# EAGLE design Zio Qwiic Eink Display Red 2.9 (EAGLE 9.1.0)
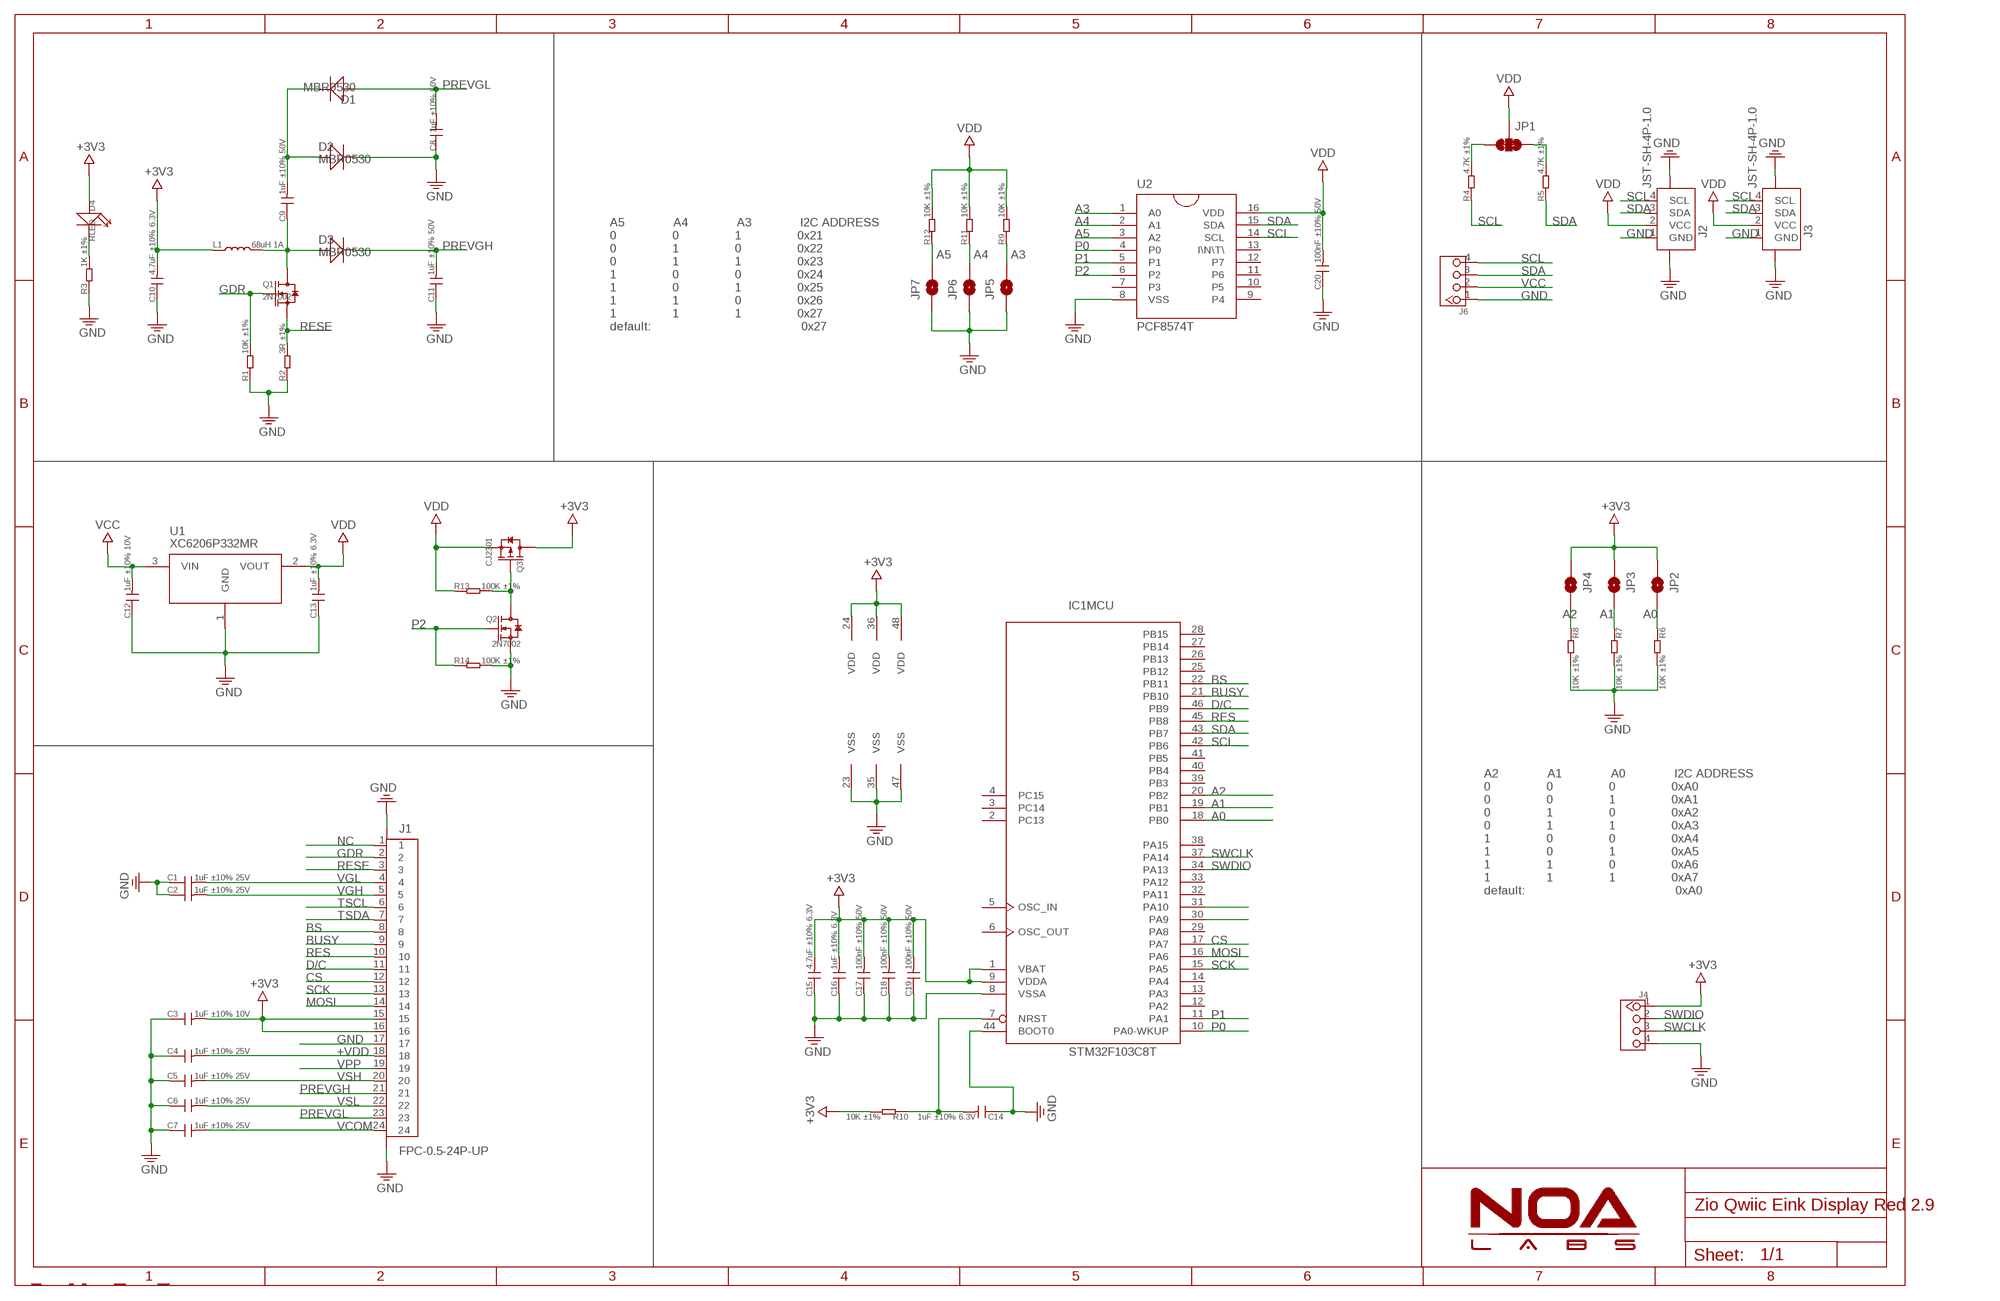
[diagram p0: schematic, sheet 1]

## Parts
C1  1uF ±10% 25V  C-0603  [C0603]
C2  1uF ±10% 25V  C-0603  [C0603]
C3  1uF ±10% 10V  C-0603  [C0603]
C4  1uF ±10% 25V  C-0603  [C0603]
C5  1uF ±10% 25V  C-0603  [C0603]
C6  1uF ±10% 25V  C-0603  [C0603]
C7  1uF ±10% 25V  C-0603  [C0603]
C8  1uF ±10% 50V  C-0603  [0603]
C9  1uF ±10% 50V  C-0603  [C0603]
C10  4.7uF ±10% 6.3V  C-0603  [C0603]
C11  1uF ±10% 50V  C-0603  [C0603]
C12  1uF ±10% 10V  C-0603  [C0603]
C13  1uF ±10% 6.3V  C-0603  [C0603]
C14  1uF ±10% 6.3V  C-0603  [C0603]
C15  4.7uF ±10% 6.3V  C-0603  [C0603]
C16  1uF ±10% 6.3V  C-0603  [C0603]
C17  100nF ±10% 50V  C-0603  [C0603]
C18  100nF ±10% 50V  C-0603  [C0603]
C19  100nF ±10% 50V  C-0603  [C0603]
C20  100nF ±10% 50V  C-0603  [C0603]
D1  MBR0530  D'1206'  [SOD123]
D2  MBR0530  D'1206'  [SOD123]
D3  MBR0530  D'1206'  [SOD123]
D4  RLED  LED'0603'  [LED-0603]
IC1  STM32F103C8T  [LQFP48]
J1  FPC-0.5-24P-UP  [FPC-0.5-24P_UP]
J2  JST-SH-4P-1.0  [JST-SH-4P]
J3  JST-SH-4P-1.0  [JST-SH-4P]
J4  HEADER-4P-2.54-SMD  [4P-2.54-SMD-180]
J6  HEADER-4P-60/35MIL  [4P-65/35MIL]
JP1  SMT-JUMPER_3_2-NC_TRACE  [SMT-JUMPER_3_2-NC_TRACE]
JP2  JUMPER-SMT_2_NC_PASTE_NOCREM  [SMT-JUMPER_2_NC_PASTE_SILK_NOCREM]
JP3  JUMPER-SMT_2_NC_PASTE_NOCREM  [SMT-JUMPER_2_NC_PASTE_SILK_NOCREM]
JP4  JUMPER-SMT_2_NC_PASTE_NOCREM  [SMT-JUMPER_2_NC_PASTE_SILK_NOCREM]
JP5  JUMPER-SMT_2_NC_PASTE_NOCREM  [SMT-JUMPER_2_NC_PASTE_SILK_NOCREM]
JP6  JUMPER-SMT_2_NC_PASTE_NOCREM  [SMT-JUMPER_2_NC_PASTE_SILK_NOCREM]
JP7  JUMPER-SMT_2_NC_PASTE_NOCREM  [SMT-JUMPER_2_NC_PASTE_SILK_NOCREM]
L1  68uH 1A  L-3012  [L3012]
Q1  2N7002  MOSFET-N-SOT23  [SOT23]
Q2  2N7002  MOSFET-N-SOT23  [SOT23]
Q3  CJ2301  MOSFET-P-SOT23  [SOT23]
R1  10K ±1%  R-0603  [R0603]
R2  3R ±1%  R-0603  [R0603]
R3  1K ±1%  R-0603  [R0603]
R4  4.7K ±1%  R-0603  [R0603]
R5  4.7K ±1%  R-0603  [R0603]
R6  10K ±1%  R-0603  [R0603]
R7  10K ±1%  R-0603  [R0603]
R8  10K ±1%  R-0603  [R0603]
R9  10K ±1%  R-0603  [R0603]
R10  10K ±1%  R-0603  [R0603]
R11  10K ±1%  R-0603  [R0603]
R12  10K ±1%  R-0603  [R0603]
R13  100K ±1%  R-0603  [R0603]
R14  100K ±1%  R-0603  [R0603]
U1  XC6206P332MR  XC6206MR  [SOT23]
U2  PCF8574T  [SO16-W]

## Nets
+3V3: C3.2 C10.2 C15.2 C16.2 C17.2 C18.2 C19.2 D4.+ IC1.1(MCU:VBAT) IC1.9(MCU:VDDA) IC1.24(VDD) IC1.36(VDD) IC1.48(VDD) J1.15 J1.16 J4.1 JP2.1 JP3.1 JP4.1 L1.1 Q3.3(D) R10.2
+VDD: C4.2 J1.18
A0: IC1.18(MCU:PB0) JP2.2 R6.1
A1: IC1.19(MCU:PB1) JP3.2 R7.1
A2: IC1.20(MCU:PB2) JP4.2 R8.1
A3: JP5.2 R9.1 U2.1(A0)
A4: JP6.2 R11.1 U2.2(A1)
A5: JP7.2 R12.1 U2.3(A2)
BS: IC1.22(MCU:PB11) J1.8
BUSY: IC1.21(MCU:PB10) J1.9
CS: IC1.17(MCU:PA7) J1.12
D/C: IC1.46(MCU:PB9) J1.11
GDR: J1.2 Q1.1(G) R1.2
GND: C1.1 C2.1 C3.1 C4.1 C5.1 C6.1 C7.1 C8.1 C10.1 C11.1 C12.1 C13.1 C14.1 C15.1 C16.1 C17.1 C18.1 C19.1 C20.1 D2.- IC1.8(MCU:VSSA) IC1.23(VSS) IC1.35(VSS) IC1.44(MCU:BOOT0) IC1.47(VSS) J1.17 J1.25(G1) J1.26(G2) J2.1(GND) J2.NC1 J2.NC2 J3.1(GND) J3.NC1 J3.NC2 J4.4 J6.1 JP5.1 JP6.1 JP7.1 Q2.2(S) R1.1 R2.1 R3.1 R6.2 R7.2 R8.2 R14.2 U1.1(GND) U2.8(VSS)
MOSI: IC1.16(MCU:PA6) J1.14
N$1: IC1.31(MCU:PA10)
N$2: C9.2 D1.- D2.+
N$3: C9.1 D3.+ L1.2 Q1.3(D)
N$4: IC1.30(MCU:PA9)
N$5: C14.2 IC1.7(MCU:NRST) R10.1
N$6: JP1.3 R4.2
N$7: D4.- R3.2
N$8: JP1.1 R5.2
N$9: Q2.3(D) Q3.1(G) R13.2
NC: J1.1
P0: IC1.10(MCU:PA0-WKUP) U2.4(P0)
P1: IC1.11(MCU:PA1) U2.5(P1)
P2: Q2.1(G) R14.1 U2.6(P2)
PREVGH: C11.2 D3.- J1.21
PREVGL: C8.2 D1.+ J1.23
RES: IC1.45(MCU:PB8) J1.10
RESE: J1.3 Q1.2(S) R2.2
SCK: IC1.15(MCU:PA5) J1.13
SCL: IC1.42(MCU:PB6) J2.4(SCL) J3.4(SCL) J6.4 R4.1 U2.14(SCL)
SDA: IC1.43(MCU:PB7) J2.3(SDA) J3.3(SDA) J6.3 R5.1 U2.15(SDA)
SWCLK: IC1.37(MCU:PA14) J4.3
SWDIO: IC1.34(MCU:PA13) J4.2
TSCL: J1.6
TSDA: J1.7
VCC: C12.2 J6.2 U1.3(VIN)
VCOM: C7.2 J1.24
VDD: C13.2 C20.2 J2.2(VCC) J3.2(VCC) JP1.2 Q3.2(S) R9.2 R11.2 R12.2 R13.1 U1.2(VOUT) U2.16(VDD)
VGH: C2.2 J1.5
VGL: C1.2 J1.4
VPP: J1.19
VSH: C5.2 J1.20
VSL: C6.2 J1.22
Unconnected: IC1.2(MCU:PC13) IC1.3(MCU:PC14) IC1.4(MCU:PC15) IC1.5(MCU:OSC_IN) IC1.6(MCU:OSC_OUT) IC1.12(MCU:PA2) IC1.13(MCU:PA3) IC1.14(MCU:PA4) IC1.25(MCU:PB12) IC1.26(MCU:PB13) IC1.27(MCU:PB14) IC1.28(MCU:PB15) IC1.29(MCU:PA8) IC1.32(MCU:PA11) IC1.33(MCU:PA12) IC1.38(MCU:PA15) IC1.39(MCU:PB3) IC1.40(MCU:PB4) IC1.41(MCU:PB5) U2.7(P3) U2.9(P4) U2.10(P5) U2.11(P6) U2.12(P7) U2.13(I\N\T\)

## Notes on the sheet
- A5              A4              A3              I2C ADDRESS
  0                0                1                0x21
  0                1                0                0x22
  0                1                1                0x23
  1                0                0                0x24
  1                0                1                0x25
  1                1                0                0x26
  1                1                1                0x27
  default:                                           0x27
- A2              A1              A0              I2C ADDRESS
  0                0                0                0xA0
  0                0                1                0xA1
  0                1                0                0xA2
  0                1                1                0xA3
  1                0                0                0xA4
  1                0                1                0xA5
  1                1                0                0xA6
  1                1                1                0xA7
  default:                                           0xA0

## Library data of the parts
C1-C7 C9-C20 = RCL:C
C8 = Discretex:C*: Ceramic Capacitors
D1-D3 = Discrete_NOA:D*
D4 = Discrete_NOA:LED*
IC1 = micro-stm_v3:STM32F103C*T: ARM 32-bit Cortex™-M3 CPU 72 MHz maximum frequency 16 to 128 Kbytes of Flash memory 6 to 20 kbytes of SRAM 37 GPIOs 2.0 to 3.6 V application supply
J1 = Connector:FPC-0.5-24P
J2 J3 = Connector:JST-SH-4P
J4 = Connector:HEADER-4P
J6 = Connector_NOA:HEADER-4P
JP1 = NOA-Jumpers:SMT-JUMPER_3_2-NC_TRACE
JP2-JP7 = NOA-Jumpers:JUMPER-SMT_2_NC_PASTE_NOCREM
L1 = RCL:L
Q1 = Discretex:MOSFET-N
Q2 = Discrete_NOA:MOSFET-N
Q3 = Discrete_NOA:MOSFET-P
R1-R14 = RCL:R
U1 = IC_NOA:XC6206MR
U2 = IC:PCF8574T

## Board
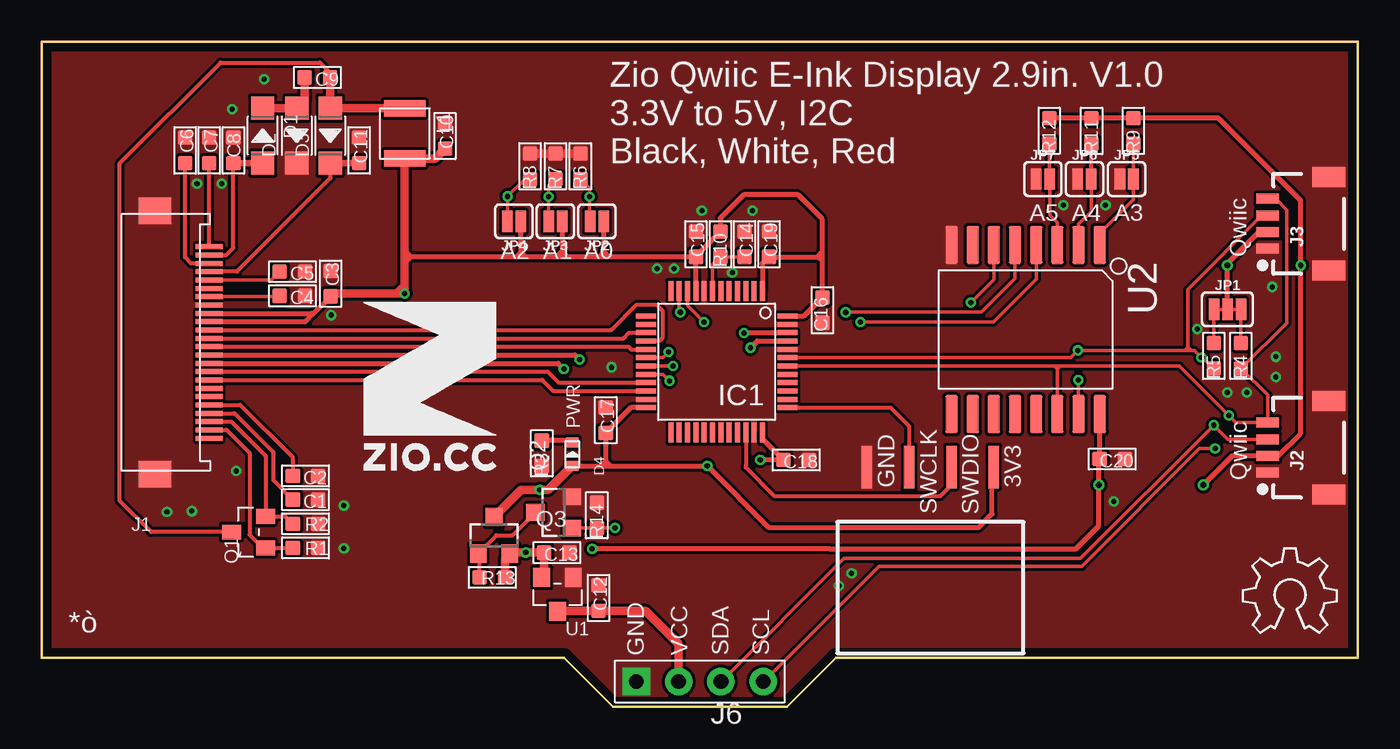
[diagram p1: board, top side]
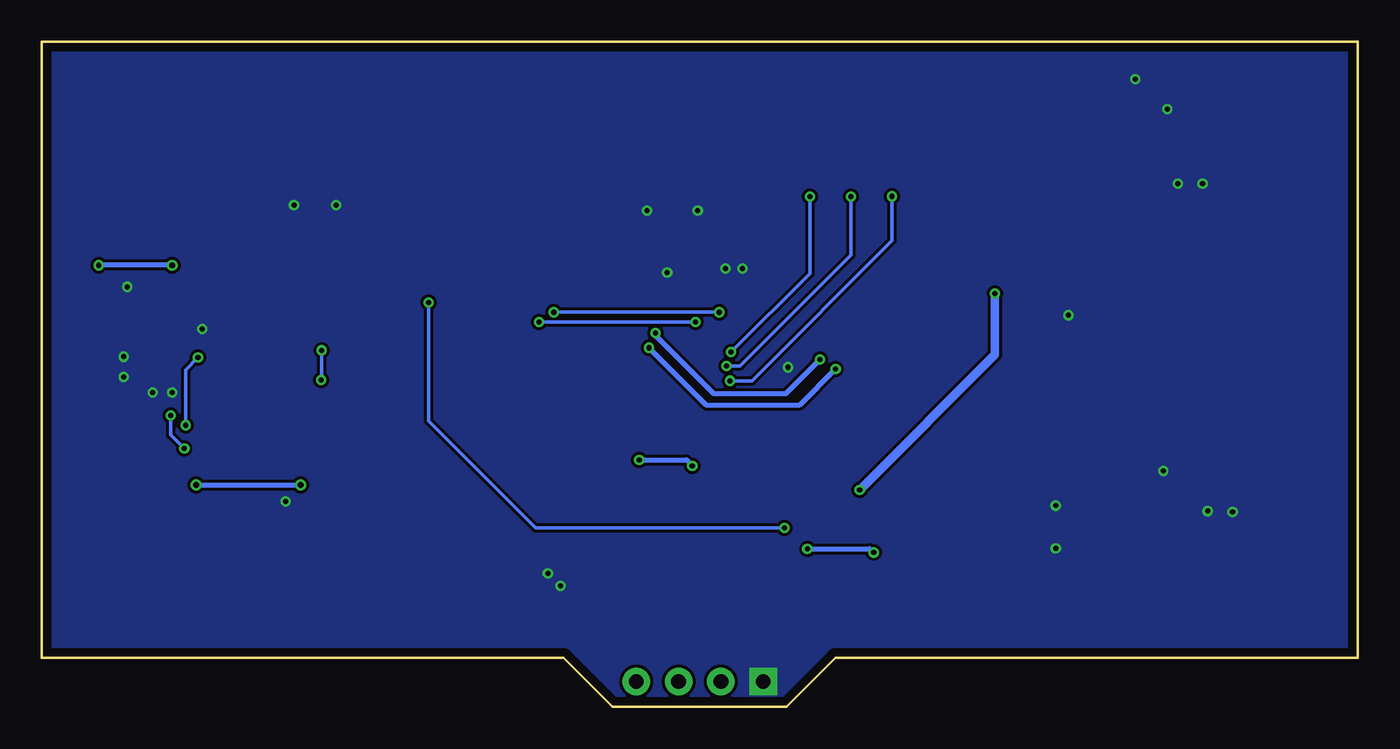
[diagram p2: board, bottom side, seen from below]

Size 79 x 39.95 mm. Coordinates in mm from the lower left corner, seen from the top.
Outline: 0,2.95 31.37,2.95 34.29,0 44.74,0 47.68,2.95 79,2.95 79,39.95 0,39.95 0,2.95
Copper layers (1*16): Top 0.035mm / dielectric 1.5mm / Bottom 0.035mm
Design rules "NOA Eagle Rule": minimum track width 7mil, minimum drill 12mil, track to track 7mil, track to pad 7mil, pad to pad 7mil, via to via 7mil, smd to smd 0mil, copper to edge 20mil, drill to drill 10mil, minimum pad ring 10mil, minimum via ring 6mil, stop-mask expansion 2mil, vias tented up to drill 25mil, thermal gap 10mil

### Footprints (pad centres in the part's own frame; a part is rotated, then mirrored left to right if it is on the bottom)
C0603 = smd 0.889 x 0.889: 1 -0.762,0; 2 0.762,0
0603 = smd 0.889 x 0.889: 1 -0.762,0; 2 0.762,0
SOD123 = smd 1.397 x 1.397: + 1.651,0; - -1.651,0
LED-0603 = smd 0.635 x 0.8: + 0.699,0; - -0.699,0
LQFP48 = smd 0.3 x 1.2: 1 -2.75,-4.25; 2 -2.25,-4.25; 3 -1.75,-4.25; 4 -1.25,-4.25; 5 -0.75,-4.25; 6 -0.25,-4.25; 7 0.25,-4.25; 8 0.75,-4.25; 9 1.25,-4.25; 10 1.75,-4.25; 11 2.25,-4.25; 12 2.75,-4.25; 25 2.75,4.25; 26 2.25,4.25; 27 1.75,4.25; 28 1.25,4.25; 29 0.75,4.25; 30 0.25,4.25; 31 -0.25,4.25; 32 -0.75,4.25; 33 -1.25,4.25; 34 -1.75,4.25; 35 -2.25,4.25; 36 -2.75,4.25 | smd 1.2 x 0.3: 13 4.25,-2.75; 14 4.25,-2.25; 15 4.25,-1.75; 16 4.25,-1.25; 17 4.25,-0.75; 18 4.25,-0.25; 19 4.25,0.25; 20 4.25,0.75; 21 4.25,1.25; 22 4.25,1.75; 23 4.25,2.25; 24 4.25,2.75; 37 -4.25,2.75; 38 -4.25,2.25; 39 -4.25,1.75; 40 -4.25,1.25; 41 -4.25,0.75; 42 -4.25,0.25; 43 -4.25,-0.25; 44 -4.25,-0.75; 45 -4.25,-1.25; 46 -4.25,-1.75; 47 -4.25,-2.25; 48 -4.25,-2.75
FPC-0.5-24P_UP = smd 0.3 x 1.6: 1 -5.75,-0.05; 2 -5.25,-0.05; 3 -4.75,-0.05; 4 -4.25,-0.05; 5 -3.75,-0.05; 6 -3.25,-0.05; 7 -2.75,-0.05; 8 -2.25,-0.05; 9 -1.75,-0.05; 10 -1.25,-0.05; 11 -0.75,-0.05; 12 -0.25,-0.05; 13 0.25,-0.05; 14 0.75,-0.05; 15 1.25,-0.05; 16 1.75,-0.05; 17 2.25,-0.05; 18 2.75,-0.05; 19 3.25,-0.05; 20 3.75,-0.05; 21 4.25,-0.05; 22 4.75,-0.05; 23 5.25,-0.05; 24 5.75,-0.05 | smd 1.6 x 1.95: 25 7.9,3.2; 26 -7.9,3.2
JST-SH-4P = smd 0.6 x 1.35: 1 1.5,0; 2 0.5,0; 3 -0.5,0; 4 -1.5,0 | smd 1.2 x 2: NC1 -2.8,3.675; NC2 2.8,3.675
4P-2.54-SMD-180 = smd 2.54 x 0.635: 1 0,3.86; 2 0,1.32; 3 0,-1.22; 4 0,-3.76
4P-65/35MIL = drill 0.889 pad 1.651 square: 1 0,3.81 | drill 0.889 pad 1.651: 2 0,1.27; 3 0,-1.27; 4 0,-3.81
SMT-JUMPER_3_2-NC_TRACE = smd 0.635 x 1.27: 1 -0.813,0; 2 0,0; 3 0.813,0
SMT-JUMPER_2_NC_PASTE_SILK_NOCREM = smd 0.635 x 1.27: 1 -0.406,0; 2 0.406,0
L3012 = smd 1 x 2.5: 1 -1.5,0; 2 1.5,0
SOT23 = smd 0.889 x 1.143: 1 -0.95,-1.016; 2 0.95,-1.016; 3 0,1.016
SOT23' = smd 1 x 1.1: 1 -0.95,-1.1; 2 0.95,-1.1; 3 0,1.1
R0603 = smd 0.889 x 0.889: 1 -0.762,0; 2 0.762,0
SOT23'' = smd 1.143 x 1.016: 1 1.016,-0.95; 2 1.016,0.95; 3 -1.016,0
SO16-W = smd 0.762 x 2.286: 1 -4.445,-5.08; 2 -3.175,-5.08; 3 -1.905,-5.08; 4 -0.635,-5.08; 5 0.635,-5.08; 6 1.905,-5.08; 7 3.175,-5.08; 8 4.445,-5.08; 9 4.445,5.08; 10 3.175,5.08; 11 1.905,5.08; 12 0.635,5.08; 13 -0.635,5.08; 14 -1.905,5.08; 15 -3.175,5.08; 16 -4.445,5.08

### Placement (x,y rotation side)
C1  15.84,12.44 180 top
C2  15.84,13.87 180 top
C3  17.35,25.42 270 top
C4  15.05,24.69 180 top
C5  15.05,26.14 180 top
C6  8.61,33.42 270 top
C7  10.06,33.42 270 top
C8  11.51,33.42 270 top
C9  16.55,37.79 180 top
C10  24.21,34.28 270 top
C11  19.05,33.42 270 top
C12  33.43,6.54 270 top
C13  30.93,9.27 180 top
C14  42.19,27.79 270 top
C15  39.27,27.79 270 top
C16  46.86,23.83 90 top
C17  33.86,17.22 270 top
C18  45.29,14.83 180 top
C19  43.66,27.79 270 top
C20  64.26,14.88 180 top
D1  13.26,34.31 270 top
D2  15.31,34.3 90 top
D3  17.32,34.3 90 top
D4  31.85,15.18 270 top
IC1  40.51,20.73 180 top
J1  10,21.89 90 top
J2  73.58,15.57 270 top
J3  73.58,29.01 270 top
J4  53.29,14.4 270 top
J6  39.5,1.52 90 top
JP1  71.17,23.88 0 top
JP2  33.32,29.16 180 top
JP3  30.84,29.16 180 top
JP4  28.35,29.16 180 top
JP5  65.12,31.7 0 top
JP6  62.6,31.7 0 top
JP7  60.1,31.7 0 top
L1  21.79,34.43 90 top
Q1  12.42,10.5 90 top
Q2  2N7002  [SOT23']  30.73,11.68 90 top
Q3  CJ2301  [SOT23']  27.15,10.31 0 top
R1  15.84,9.55 180 top
R2  15.84,11 180 top
R3  30.02,15.22 90 top
R4  71.98,21.08 90 top
R5  70.36,21.08 90 top
R6  32.33,32.46 90 top
R7  30.84,32.46 90 top
R8  29.31,32.46 90 top
R9  65.53,34.59 90 top
R10  40.74,27.79 90 top
R11  63.02,34.58 90 top
R12  60.48,34.59 90 top
R13  27.05,7.77 180 top
R14  33.32,11.51 90 top
U1  XC6206P332MR  [SOT23'']  30.96,6.77 90 top
U2  59.06,22.66 180 top
U$10  [OSHW_6X200_NOTEXT]  72.09,4.45 0 top
U$20  [10MM]  19.3,14.22 0 top

### Tracks (layer width: path | path; a pad name or v marks a point on that pad's centre or on a via)
+3V3  (via drill 0.3)
  Top 0.305: J1.16 16.22,23.64 16.27,23.58 | J1.15 15.83,23.14 16.27,23.58 | 16.27,23.58 C3.2 | IC1.24 35.38,17.98 C17.2 33.86,14.76 | IC1.9 39.27,26.87 C15.2 34.06,27.03 | IC1.48 45.75,23.48 C16.2 46.86,26.8 | IC1.36 43.26,16.1 C18.2 v43.13,14.83 | 39.27,27.08 R10.2 40.74,29.34 42.16,30.76 45.39,30.76 46.86,29.29 46.86,27.33 | IC1.1 43.26,26.63 C19.2 46.56,27.03 | 34.06,27.03 33.45,27.03 | 33.45,27.03 31.57,27.03 | 31.57,27.03 30.91,27.03 | JP3.1 31.24,27.36 | 31.24,27.36 31.57,27.03 | 31.24,27.36 30.91,27.03 | JP2.1 33.73,27.36 | 33.73,27.36 34.06,27.03 | 33.73,27.36 33.73,27.3 33.45,27.03 | 46.86,26.8 46.86,27.33 | 46.56,27.03 46.86,27.33 | 46.56,27.03 46.63,27.03 46.86,26.8 | 30.91,27.03 29.03,27.03 | 29.03,27.03 28.47,27.03 | 28.47,27.03 22.17,27.03 | 22.17,27.03 21.79,27.41 | 22.17,27.03 21.78,26.64 21.78,26.57 | 28.75,27.3 29.03,27.03 | JP4.1 28.75,27.3 | 28.75,27.3 28.47,27.03 | 33.63,14.48 D4.+ 31.55,14.17 | 33.63,14.48 34.14,14.48 | 34.14,14.48 v39.95,14.48 43.64,10.79 56.26,10.79 57.05,11.58 57.05,14.3 J4.1 | 33.86,14.76 34.14,14.48 | 33.86,14.76 33.63,14.53 33.63,14.48
  Top 0.508: C10.2 23.61,32.92 L1.1 21.79,27.41 21.78,26.57 21.78,26.09 | 21.78,25.15 v21.78,24.82 21.34,24.82 | 21.78,25.15 21.78,25.63 | 21.78,25.63 21.78,26.09 | C3.2 17.51,24.82 21.34,24.82 | 39.27,27.08 39.27,26.87 | 21.34,24.82 21.67,25.15 21.78,25.15 | Q3.3 28.77,13.03 v29.9,13.03 30.41,13.03 31.55,14.17 31.83,14.46 | 21.78,25.63 21.78,26.09
  Bottom 0.305: v43.13,14.83 40.3,14.83 v39.95,14.48
  Bottom 0.508: v21.78,24.82 21.78,21.15 v29.9,13.03
+VDD
  Top 0.203: C4.2 14.24,24.64 J1.18
A0  (via drill 0.3)
  Top 0.203: v37.62,21.31 37.28,20.98 IC1.18 | R6.1 32.89,31.14 v32.89,30.63 32.89,29.18 JP2.2
  Bottom 0.203: v37.62,21.31 32.89,26.04 v32.89,30.63
A1  (via drill 0.3)
  Top 0.203: v37.89,20.48 v37.9,20.47 v37.89,20.48 | R7.1 30.43,31.29 v30.43,30.63 JP3.2 | v37.89,20.48 IC1.19
  Bottom 0.203: v37.9,20.47 37.08,20.47 30.43,27.13 v30.43,30.63
A2  (via drill 0.3)
  Top 0.203: v37.69,19.58 37.3,19.98 IC1.20 | JP4.2 27.96,29.18 v27.96,30.66 29.01,31.7 R8.1
  Bottom 0.203: v37.69,19.58 36.37,19.58 27.96,27.99 v27.96,30.66
A3
  Top 0.203: R9.1 JP5.2 65.53,30.48 63.5,28.45 U2.1
A4
  Top 0.203: 63,33.81 R11.1 | JP6.2 63,29.75 62.23,28.98 U2.2
  Top 0.254: JP6.2 63,33.81
A5
  Top 0.203: R12.1 60.48,31.72 JP7.2 60.5,29.54 60.96,29.08 U2.3
BS
  Top 0.254: IC1.22 30.71,18.98 30.05,19.64 J1.8
BUSY
  Top 0.254: IC1.21 31.04,19.48 30.38,20.14 J1.9
CS
  Top 0.254: IC1.17 35.38,21.48 35.22,21.64 J1.12
D/C  (via drill 0.3)
  Top 0.305: J1.11 32,21.14 v32.28,20.85 | v42.16,22.45 42.19,22.48 IC1.46
  Bottom 0.305: v32.28,20.85 34.34,18.8 38.66,18.8 42.16,22.3 v42.16,22.45
GDR
  Top 0.254: J1.2 11.1,16.64 12.47,15.26 12.47,10.34 13.26,9.55 Q1.1 R1.2 | R1.2
GND  (via drill 0.3)
  Top 0.508: R8.2 R7.2 R6.2
  other vias: 10.79,31.42 11.43,35.89 9.32,31.42 9.02,11.76 11.68,14.17 13.36,37.69 7.52,11.71 18.14,12.09 18.14,9.53 73.86,25.22 34.21,20.4 69.37,22.68 74.07,21.03 74.07,19.81 71.17,18.87 72.34,18.87 42.67,29.79 39.62,29.79 41.45,26.09 17.37,23.52 37.95,26.31 36.93,26.31 61.32,30.12 63.86,30.12 64.36,12.34 48.62,8.03 47.85,7.26
  pour Bottom (no thermals): 0,0 0,39.95 78.97,39.95 78.97,0
  pour Top (no thermals): 0,0 78.97,0 78.97,39.95 0,39.95
MOSI
  Top 0.254: IC1.16 37.09,21.98 37.26,22.15 37.26,23.8 36.91,24.16 35.71,24.16 34.19,22.64 J1.14
N$2
  Top 0.508: D1.- D2.+ 15.79,36.42 C9.2
N$3
  Top 0.254: 17.32,37.78 17.32,38.08 16.71,38.68 10.74,38.68 4.7,32.64 4.7,12.37 6.57,10.5 Q1.3
  Top 0.508: C9.1 17.32,37.78 D3.+ 21.49,35.95 L1.2
N$5
  Top 0.203: IC1.7 40.26,26.55 R10.1 C14.2
N$6
  Top 0.203: JP1.3 R4.2
N$7
  Top 0.305: D4.- 31.74,15.99 R3.2
N$8
  Top 0.203: JP1.1 R5.2
N$9
  Top 0.254: R13.2 26.29,9.13 Q3.1 27.3,10.31 28.26,10.31 Q2.3
P0  (via drill 0.3)
  Top 0.203: U2.4 59.69,25.68 57.13,23.11 v49.15,23.11 | IC1.10 38.76,24.1 v39.75,23.11
  Bottom 0.203: v39.75,23.11 v49.15,23.11
P1  (via drill 0.3)
  Top 0.203: U2.5 58.42,25.71 56.41,23.7 v48.26,23.7 | IC1.11 38.26,23.76 v38.33,23.7
  Bottom 0.203: v38.33,23.7 v48.26,23.7
P2  (via drill 0.3)
  Top 0.203: U2.6 57.15,25.66 v55.78,24.28 | v34.42,10.74 R14.1 31.84,10.74 Q2.1
  Bottom 0.203: v55.78,24.28 55.78,17.17 49.35,10.74 v34.42,10.74
PREVGH
  Top 0.254: C11.2 | J1.21 11.71,26.14 17.32,31.75 D3.-
  Top 0.381: D3.- C11.2
PREVGL
  Top 0.254: J1.23 11.08,27.14 11.51,27.56 C8.2
  Top 0.381: C8.2 D1.+
RES  (via drill 0.3)
  Top 0.305: J1.10 31,20.64 v31.34,20.3 | v42.55,21.57 42.96,21.98 IC1.45
  Bottom 0.305: v31.34,20.3 33.53,18.11 39.09,18.11 v42.55,21.57
RESE
  Top 0.254: J1.3 11.36,17.14 13.44,15.06 Q1.2 14.62,11.45 R2.2
SCK
  Top 0.254: IC1.15 35.26,22.48 34.91,22.14 J1.13
SCL  (via drill 0.3)
  Top 0.203: IC1.42 60.78,20.48 | 60.78,20.48 61.14,20.48 | 61.14,20.48 68.1,20.48 | 68.1,20.48 68.27,20.48 | J3.4 74.06,30.51 74.73,29.84 74.73,23.06 R4.1 73.58,18.72 J2.4 71.68,17.07 v71.25,17.5 68.27,20.48 | v70.43,15.52 69.5,15.52 62.44,8.46 50.24,8.46 J6.4 | 68.27,20.48 68.1,20.48 | U2.14 60.96,20.3 | 60.96,20.3 61.14,20.48 | 60.96,20.3 60.79,20.48 60.78,20.48
  Bottom 0.203: v70.43,15.52 71.25,16.33 v71.25,17.5
SDA  (via drill 0.3)
  Top 0.203: R5.1 69.7,20.98 v69.62,20.98 69.19,21.41 68.96,21.41 | 68.78,21.61 68.78,25.08 73.21,29.51 J3.3 | J2.3 71.2,16.07 v70.36,16.92 62.36,8.91 48.16,8.91 J6.3 | IC1.43 61.77,20.98 v62.2,21.41 68.58,21.41 | v62.23,19.63 U2.15 | 68.58,21.41 68.78,21.61 | 68.96,21.41 68.58,21.41 | 68.78,21.61 68.96,21.44 68.96,21.41
  Bottom 0.203: v70.36,16.92 70.36,20.24 v69.62,20.98 | v62.2,21.41 62.2,19.66 v62.23,19.63
SWCLK
  Top 0.254: IC1.37 50.96,17.98 52.07,16.87 J4.3
SWDIO
  Top 0.254: IC1.34 42.26,14.5 42.26,14.38 43.99,12.65 53.92,12.65 54.61,13.33 J4.2
VCC
  Top 0.508: 31,5.78 C12.2 35.36,5.78 36.23,5.78 38.23,3.78 J6.2
  Top 0.813: U1.3 31,5.78
VCOM
  Top 0.254: C7.2 J1.24
VDD  (via drill 0.3, 0.35)
  Top 0.305: J3.2 73.06,28.51 71.17,26.62 v71.17,26.52 JP1.2 | v69.72,13.34 71.46,15.07 J2.2 74.2,15.07 75.56,16.43 v75.56,26.52 75.56,30.4 70.61,35.36 R9.2 R11.2 60.49,35.35 R12.2 | v33.05,9.5 47.3,9.5 62.08,9.5 63.45,10.88 v63.45,13.34 63.45,14.81 63.5,14.86 63.5,15.16 | 63.5,15.16 U2.16 | C20.2 63.5,15.16
  Top 0.508: 30.16,7.94 U1.2 30.16,7.94 | 28.16,9.27 v29.06,9.27 C13.2 30.16,7.94 | 28.16,9.27 Q3.2 | R13.1 27.81,8.92 28.16,9.27
  Bottom 0.305: v69.72,13.34 v63.45,13.34 | v33.05,9.5 29.29,9.5 v29.06,9.27 | v71.17,26.52 v75.56,26.52
VGH
  Top 0.203: 15.05,13.89 C2.2
  Top 0.254: J1.5 11.91,18.14 15.05,15 15.05,13.89
VGL
  Top 0.254: J1.4 11.57,17.64 13.92,15.29 13.92,13.6 C1.2
VSH
  Top 0.203: C5.2 13.79,25.64 J1.20
VSL
  Top 0.254: C6.2 8.61,27 8.97,26.64 J1.22

### Text on the board
tPlace: Zio Qwiic E-Ink Display 2.9in. V1.0 / 3.3V to 5V, I2C / Black, White, Red | A5 | A4 | A3 | A2 | A1 | A0 | Qwiic | PWR | Qwiic | GND | 3V3 | SWCLK | SWDIO | *ò | GND | VCC | SDA | SCL